# Altium schematic sheet Power_Supply.SchDoc: Wacky Racer Power Supply
size A3; Author: IPA & DHA; DrawnBy: IPA & DHA; Organization: Group 33; Address1: ECE Department; Address2: University of Canterbury; Address3: Christchurch 8041; Address4: New Zealand; DocumentNumber: 005; Revision: 1; SheetNumber: 3; SheetTotal: 3; ImagePath: \\maxwell\elecapp\AltiumDesigner\Templates\uc-logo.png
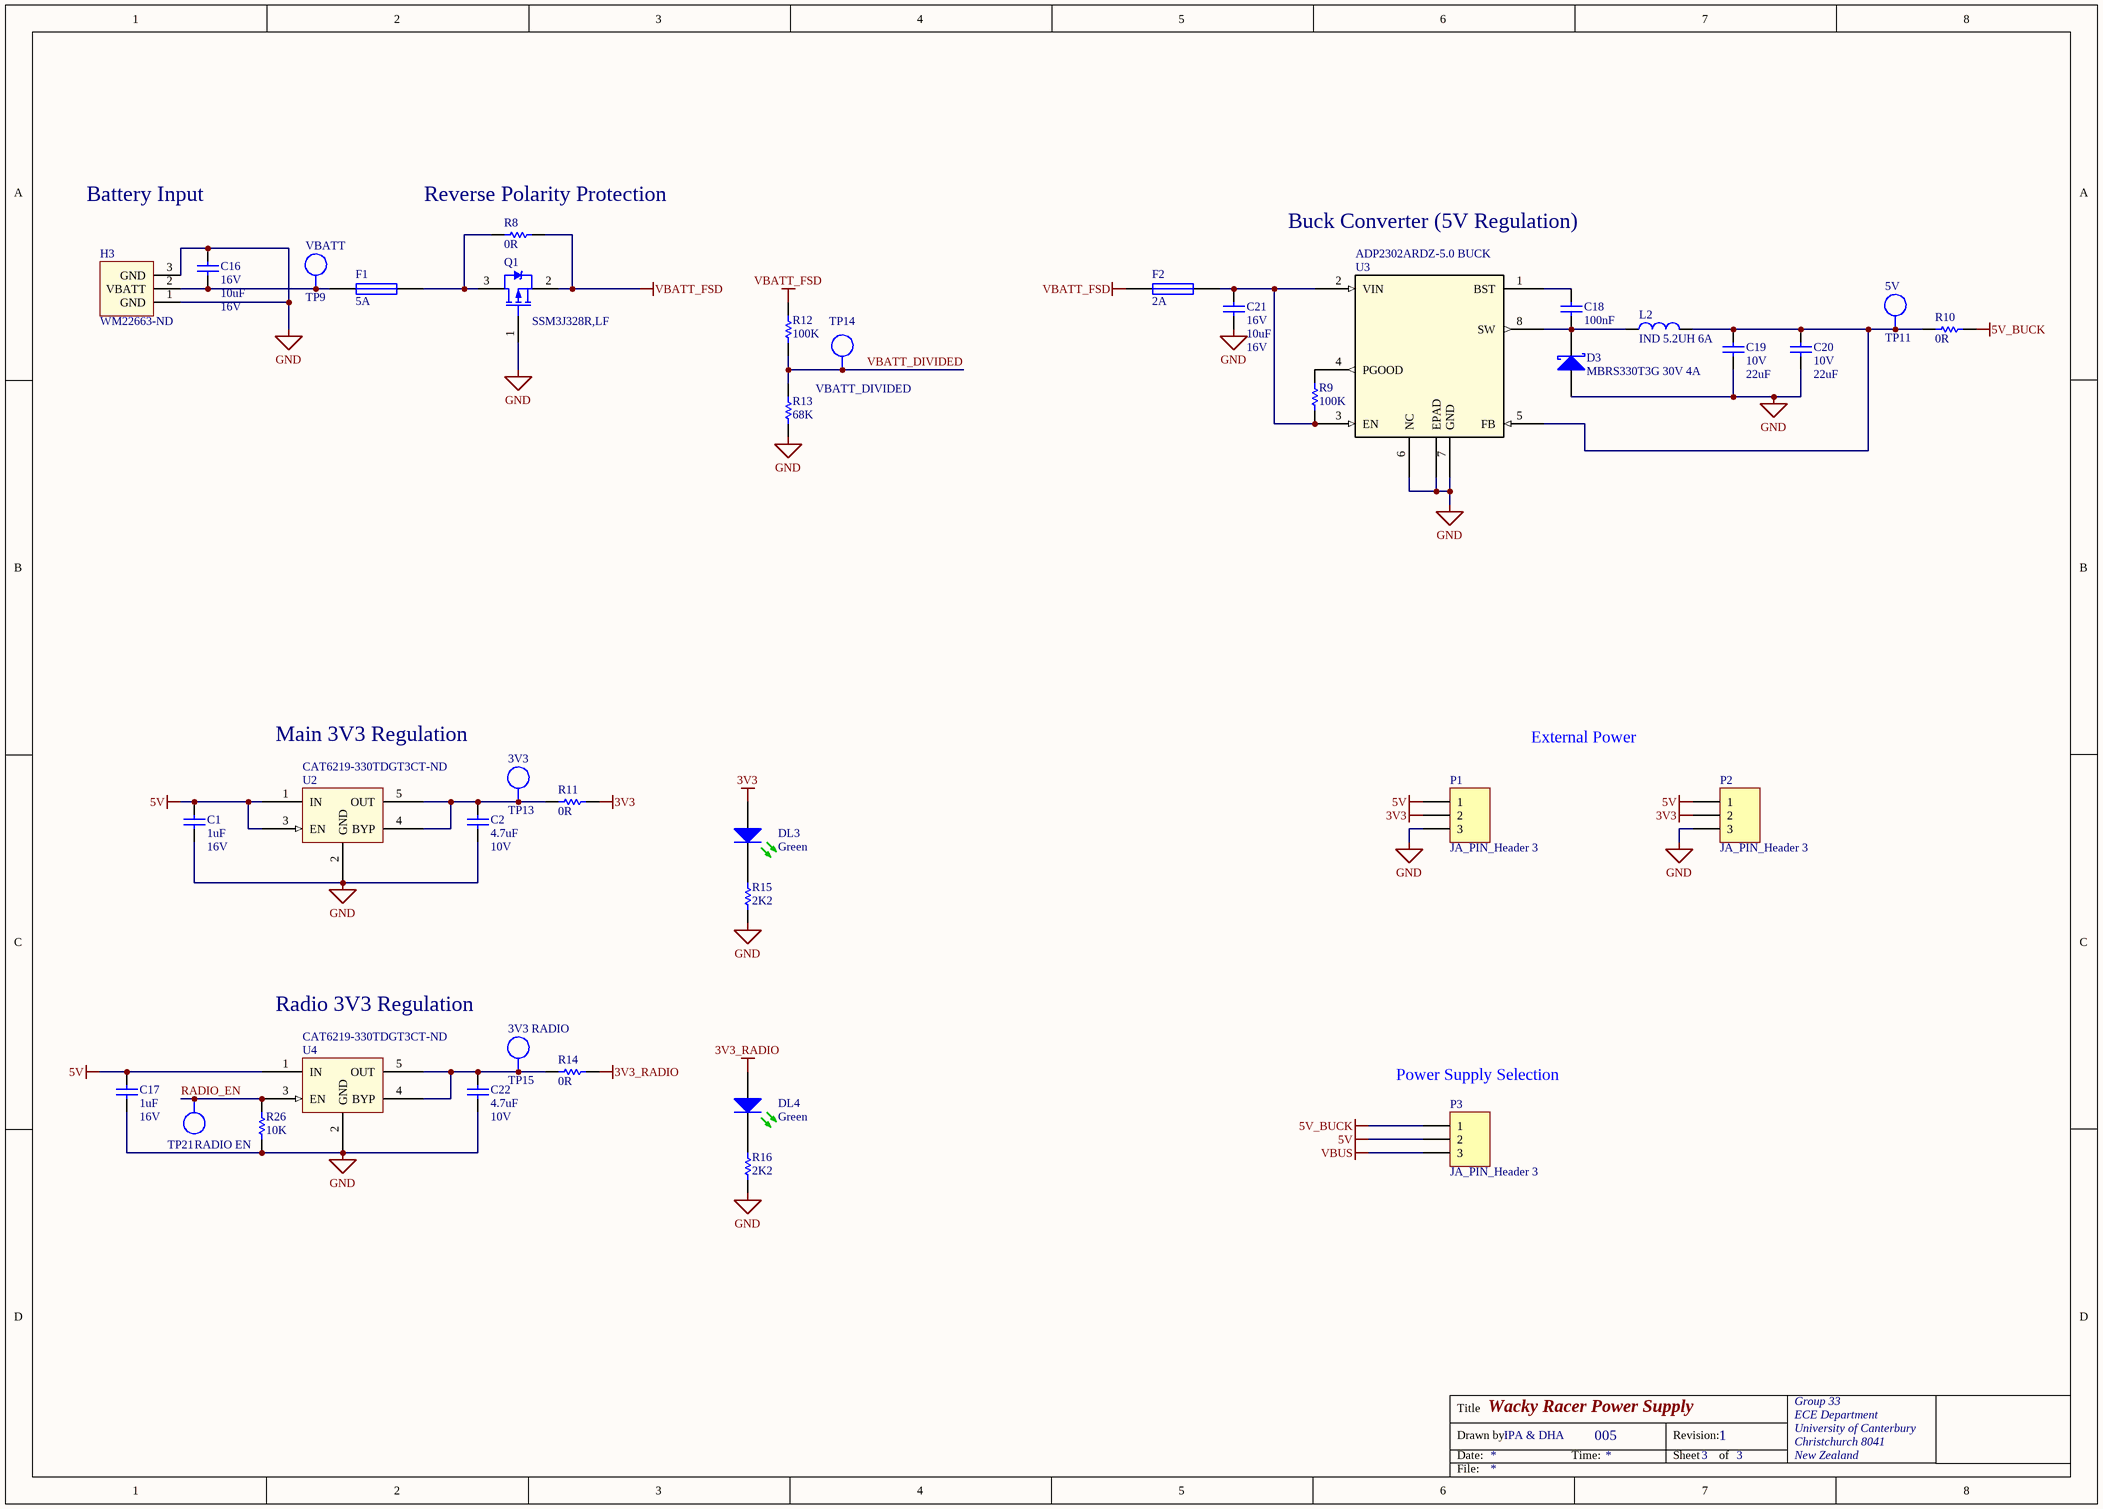
[diagram p0: Power_Supply.SchDoc]

## Parts
C1  Max Voltage: 16V  [CAPC1608L]  (hidden comment: 1uF)
C2  Max Voltage: 10V  [CAPC1608N]  (hidden comment: 4.7uF)
C16  Voltage - Rated: 16V  [CAPC2012L]  (hidden comment: 10uF)
C17  Max Voltage: 16V  [CAPC1608L]  (hidden comment: 1uF)
C18  100nF  [CAPC1608L]
C19  Max Voltage: 10V  [CAPC3216L]  (hidden comment: 22uF)
C20  Max Voltage: 10V  [CAPC3216L]  (hidden comment: 22uF)
C21  Voltage - Rated: 16V  [CAPC2012L]  (hidden comment: 10uF)
C22  Max Voltage: 10V  [CAPC1608N]  (hidden comment: 4.7uF)
D3  MBRS330T3G 30V 4A  [SMC]
DL3  Green  [WL-SMCW0603]
DL4  Green  [WL-SMCW0603]
F1  5A  [RESC3216N]
F2  2A  [RESC3216N]
H3  Supplier Part Number 1: WM22663-ND  [BATT_HEADER_3POS]  (hidden comment: Battery_HEADER_3pin)
L2  IND 5.2UH 6A  [INDUCTOR5u2]
P1  JA_PIN_Header 3  [HDR1X3]
P2  JA_PIN_Header 3  [HDR1X3]
P3  JA_PIN_Header 3  [HDR1X3]
Q1  SSM3J328R,LF  [SOT23_L]
R8  0R  [RESC1608L]
R9  100K  [RESC1608L]
R10  0R  [RESC1608L]
R11  0R  [RESC1608L]
R12  100K  [RESC1608L]
R13  68K  [RESC1608L]
R14  0R  [RESC1608L]
R15  2K2  [RESC1608L]
R16  2K2  [RESC1608L]
R26  10K  [RESC1608L]
TP9  VBATT  [TP_1206]  (no BOM)
TP11  5V  [TP_1206]  (no BOM)
TP13  3V3  [TP_1206]  (no BOM)
TP14  VBATT_DIVIDED  [TP_1206]  (no BOM)
TP15  3V3 RADIO  [TP_1206]  (no BOM)
TP21  RADIO EN  [TP_1206]  (no BOM)
U2  Supplier Part Number: CAT6219-330TDGT3CT-ND  [SOT95P280X145-5N]  (hidden comment: CAT6219-330TDGT3)
U3  ADP2302ARDZ-5.0 BUCK  [RD_8_1]
U4  Supplier Part Number: CAT6219-330TDGT3CT-ND  [SOT95P280X145-5N]  (hidden comment: CAT6219-330TDGT3)

## Nets
3V3: DL3.2(A) P1.2 P2.2 R11.2
3V3_RADIO: DL4.2(A) R14.2
5V: C1.1 C17.1 P1.1 P2.1 P3.2 U2.1(IN) U2.3(EN) U4.1(IN)
5V_BUCK: P3.1 R10.2
GND: C1.2 C2.1 C16.2 C17.2 C19.1 C20.1 C21.1 C22.1 D3.1(A) H3.1(GND) H3.3(GND) P1.3 P2.3 Q1.1 R13.1 R15.1 R16.1 R26.1 U2.2(GND) U3.6(NC) U3.7(GND) U3.EPAD U4.2(GND)
VBATT_FSD: F2.1 Q1.2 R8.2 R12.2
VBUS: P3.3
RADIO_EN: R26.2 TP21.1 U4.3(EN)
VBATT_DIVIDED: R12.1 R13.2 TP14.1
NetC2_2: C2.2 R11.1 TP13.1 U2.4(BYP) U2.5(OUT)
NetC16_1: C16.1 F1.1 H3.2(VBATT) TP9.1
NetC18_1: C18.1 D3.2(K) L2.1 U3.8(SW)
NetC18_2: C18.2 U3.1(BST)
NetC19_2: C19.2 C20.2 L2.2 R10.1 TP11.1 U3.5(FB)
NetC21_2: C21.2 F2.2 R9.1 U3.2(VIN) U3.3(EN)
NetC22_2: C22.2 R14.1 TP15.1 U4.4(BYP) U4.5(OUT)
NetDL3_1: DL3.1(K) R15.2
NetDL4_1: DL4.1(K) R16.2
NetF1_2: F1.2 Q1.3 R8.1
NetR9_2: R9.2 U3.4(PGOOD)

## Notes on the sheet
- Battery Input
- (near R8) Reverse Polarity Protection
- Buck Converter (5V Regulation)
- Main 3V3 Regulation
- External Power
- Radio 3V3 Regulation
- (near P3) Power Supply Selection
- Title
- Drawn by:
- Date:
- Time:
- Revision:
- Sheet
- of
- File:

## Library data of the parts
C1 C17 = CC_1uF_0603: CAP CER 1uF Y5V -20% +80% 16V 0603; PackageReference: 0603; Code_IPC: 1608 [0603]; Verify: *; Supplier: ECE Dept; Storage Location: PCB Assembly WS; Value: 1uF
C2 C22 = CC_4.7uF_0603: CAP CER 4.7uF X5R +-20%  10V 0603; Note: Footprint corresponds to dimensions for bulk cassette packaging. This case size has tightened tolerances.; PackageReference: 0805; Code_IPC: 2012[0805]; Verify: *; Supplier: ECE Dept; Storage Location: PCB Assembly WS; Value: 4.7uF
C16 C21 = CC_10uF_0805_16V: CAP CER 10uF X5R 16V 0805; Manufacturer: Samsung Electro-Mechanics; Manufacturer Part Number: CL21A106KOQNNWE; Note: Footprint corresponds to dimensions for bulk cassette packaging. This case size has tightened tolerances.; Tolerance: ±10%; Notification: Current market demand for these product types have resulted in fluctuating and extending lead times. Lead times may differ.; PackageReference: 0805; Code_IPC: 2012[0805]; Supplier 1: Digi-Key; RoHS: RoHS Compliant; Category: Capacitors; Stock 1: 20000; Pricing 1: 1=0.35, 10=0.25, 100=0.1178, 500=0.08254, 1000=0.06831 (NZD); Packaging: Cut Tape (CT); Part Status: Active; Temperature Coefficient: X5R; Operating Temperature: -55°C ~ 85°C; Features: -; Ratings: -; Applications: General Purpose; Mounting Type: Surface Mount, MLCC; Package / Case: 0805 (2012 Metric); Size / Dimension: 0.079" L x 0.049" W (2.00mm x 1.25mm); Height - Seated (Max): -; Thickness (Max): 0.055" (1.40mm); Lead Spacing: -; Lead Style: -; ComponentLink1URL: http://www.samsungsem.com/kr/support/product-search/mlcc/CL21A106KOQNNWE.jsp; ComponentLink1Description: http://www.samsungsem.com/kr/support/product-search/mlcc/CL21A106KOQNNWE.jsp; Supplier Part Number 1: 1276-2894-1-ND; Value: 10uF; Max Voltage: 16V
C18 = CC_100nF_0603: CAP CER 100nF X7R +-10% 50V 0603; PackageReference: 0603; Code_IPC: 1608 [0603]; Verify: *; Supplier: ECE Dept; Storage Location: PCB Assembly WS; Value: 100nF
C19 C20 = CC_22uF_1206: CAP CER 22uF Y5V -20% +80% 10V 1206; Verify: *; Supplier: ECE Dept; Storage Location: PCB Assembly WS; Dielectric: Y5V; Footprint: 1206 (3216 metric); Value: 22uF
D3 = MBRS330T3G: SCHOTTKY  30V 4A; Manufacturer: ON Semiconductor; Speed: Fast Recovery =< 500ns, > 200mA (Io); Supplier 1: Digi-Key; Manufacturer Part Number: MBRS330T3G; RoHS: RoHS Compliant; Category: Discrete Semiconductor Products; Stock 1: 8919; Pricing 1: 1=0.93, 10=0.79, 100=0.5902, 500=0.46368, 1000=0.35829 (NZD); Packaging: Cut Tape (CT); Part Status: Active; Diode Type: Schottky; Current - Average Rectified (Io): 4A; Capacitance @ Vr, F: -; Mounting Type: Surface Mount; Package / Case: DO-214AB, SMC; Supplier Device Package: SMC; Operating Temperature - Junction: -65°C ~ 150°C; Base Part Number: MBRS330; ComponentLink1URL: http://www.onsemi.com/pub/Collateral/MBRS340T3-D.PDF; ComponentLink1Description: http://www.onsemi.com/pub/Collateral/MBRS340T3-D.PDF; Supplier Part Number 1: MBRS330T3GOSCT-ND
DL3 DL4 = DL_150060GS75000: LED Green 430mcd 0603 SMD; Manufacturer: WURTH ELEKTRONIK; Forward Current If: 30; Wavelength Typ: 520; Forward Voltage: 3.2; Lens Shape: Rectangular; Luminous Intensity: 430; Viewing Angle: 140°; LED Mounting: SMD; Supplier 1: Farnell; Supplier Part Number 1: 2322070; Manufacturer Part Number: 150060GS75000; Storage Location: PCB Assembly WS; Supplier: ECE Dept; LED Colour: Green
F1 = FS_Fuse_5.0A: Fuse 5.0A Fast Acting 1206 SMD; Manufacturer Part Number: C1F5; Manufacturer: Bel TRP; Voltage Rating (AC): 125V; Voltage Rating (DC): 63V; DC Cold Resistance: 19mR; Fuse Type: Board Mount (Cartridge Style Excluded); Approvals: CE,cURus; Mount: Surface Mount; Case/Package: 1206; Number of Pins: 2; Case Code (Metric): 3216; Case Code (Imperial): 1206; Contact Plating: Nickel,Tin; Min Operating Temperature: -55°C; Max Operating Temperature: 125°C; Packaging: Tape and Reel; Voltage Rating: 125V; Length: 0.126inch; Width: 0.062inch; Supplier 1: Digi-Key; Stock 1: 725; Pricing 1: 1=0.32, 5=0.312, 10=0.298, 50=0.2662, 100=0.2479, 250=0.22032, 500=0.1836, 1000=0.17442 (USD); ComponentLink1URL: http://www.farnell.com/datasheets/2571625.pdf; ComponentLink1Description: http://www.farnell.com/datasheets/2571625.pdf; ComponentLink2URL: http://belfuse.com/pdfs/C1F.pdf; ComponentLink2Description: http://belfuse.com/pdfs/C1F.pdf; ComponentLink3URL: http://www.mouser.com/ds/2/643/C1F-594910.pdf; ComponentLink3Description: http://www.mouser.com/ds/2/643/C1F-594910.pdf; ComponentLink4URL: https://belfuse.com/resources/StewartConnector/C1F.pdf; ComponentLink4Description: https://belfuse.com/resources/StewartConnector/C1F.pdf; Current Rating: 5A; Supplier Part Number 1: 507-1886-1-ND; Supplier 2: Element14; Supplier Part Number 2: 2848595; Value: 5A
F2 = FS_Fuse_2.0A: Fuse 2.0A Very Fast Acting 1206 SMD; Manufacturer: MULTICOMP; Manufacturer PN: MC12CF 002; Supplier: ECE Dept; Storage Location: PCB Assembly WS; Supplier 1: Farnell; Supplier Part Number 1: 1841029; Manufacturer Part Number: MC12CF 002; Value: 2A
H3 = Battery_HEADER_3pin: 3Pin Header 2.54mm spacing / Digikey #WM22663-ND; Supplier 1: Digi-Key
L2 = CDRH104RNP-5R2NC: FIXED IND 5.2UH 6A 22 MOHM SMD; Manufacturer: Sumida America Components Inc.; Material - Core: Ferrite; Tolerance: ±30%; Current - Saturation: 5.6A; Shielding: Shielded; DC Resistance (DCR): 22 mOhm Max; Supplier 1: Digi-Key; Manufacturer Part Number: CDRH104RNP-5R2NC; RoHS: RoHS Compliant; Category: Inductors, Coils, Chokes; Stock 1: 3849; Pricing 1: 1=2.9, 10=2.678, 100=1.8743, 500=1.5173 (NZD); Packaging: Cut Tape (CT); Part Status: Active; Type: -; Q @ Freq: -; Frequency - Self Resonant: -; Ratings: -; Operating Temperature: -40°C ~ 100°C; Mounting Type: Surface Mount; Package / Case: Nonstandard; Supplier Device Package: -; Size / Dimension: 0.402" L x 0.394" W (10.20mm x 10.00mm); Height - Seated (Max): 0.157" (4.00mm); ComponentLink1URL: http://products.sumida.com/products/pdf/CDRH104R.pdf; ComponentLink1Description: http://products.sumida.com/products/pdf/CDRH104R.pdf; Supplier Part Number 1: 308-2280-1-ND
P1-P3 = JA_PIN_Header 3: Header, 3-Pin; LatestRevisionDate: 17-Jul-2002; LatestRevisionNote: Re-released for DXP Platform.; Publisher: Altium Limited
Q1 = TM_SSM3J328R: MOSFET P-CH 20V 6A SOT23-3; Manufacturer: Toshiba; FET Feature: Logic Level Gate, 1.5V Drive; FET Type: MOSFET P-Channel, Metal Oxide; Gate Charge (Qg) @ Vgs: 12.8nC @ 4.5V; Input Capacitance (Ciss) @ Vds: 840pF @ 10V; Power - Max: 1W; Rds On Max: 29.8mR; Drain to Source Resistance: 47.4mR; Turn-On Delay Time: 32ns; Power Dissipation: 2W; Number of Channels: 1; Turn-Off Delay Time: 107ns; Gate to Source Voltage (Vgs): 8V; Input Capacitance: 840pF; Element Configuration: Single; Drain to Source Breakdown Voltage: -20V; Vgs(th) (Max) @ Id: 1V @ 1mA; Current - Continuous Drain (Id) @ 25° C: 6A; Drain to Source Voltage (Vdss): 20V; Package / Case: SOT-23-3 Flat Leads; Supplier Device Package: SOT-23F; Pricing: 1=0.79, 10=0.658, 25=0.5772, 100=0.4939, 250=0.42836, 500=0.36284, 1000=0.27972 (NZD); Storage Location: PCB Assembly WS; Supplier: Digi-Key; ComponentLink1URL: https://datasheet.ciiva.com/11158/ssm3j328r-datasheet-en-20140301-11158652.pdf; ComponentLink1Description: https://datasheet.ciiva.com/11158/ssm3j328r-datasheet-en-20140301-11158652.pdf; Supplier Part Number: SSM3J328RLFDKR-ND; Max Operating Temperature: 150°C; Mount: Surface Mount; Packaging: Tape and Reel; Min Operating Temperature: -55°C; Continuous Drain Current (ID): 6A; Radiation Hardening: No; Max Power Dissipation: 1W; Package Quantity: 3000; Case/Package: SOT-23-3; Number of Pins: 3; Number of Elements: 1; Supplier 1: Digi-Key; Supplier Part Number 1: SSM3J328RLFDKR-ND; Manufacturer Part Number: SSM3J328R,LF
R8 R10 R11 R14 = RS_0R0: RES 0.0 OHM 1/10W 5% 0603 SMD; Storage Location: PCB Assembly WS; Supplier: ECE Dept; Value: 0R
R9 R12 = RS_100K: RES 100K OHM 1/10W 5% 0603 SMD; Storage Location: PCB Assembly WS; Supplier: ECE Dept; Value: 100K
R13 = RS_68K: RES 68.0K OHM 1/10W 5% 0603 SMD; Storage Location: PCB Assembly WS; Supplier: ECE Dept; Value: 68K
R15 R16 = RS_2K2: RES 2.2K OHM 1/10W 5% 0603 SMD; Storage Location: PCB Assembly WS; Supplier: ECE Dept; Value: 2K2
R26 = RS_10K: RES 10.0K OHM 1/10W 5% 0603 SMD; Storage Location: PCB Assembly WS; Supplier: ECE Dept; Value: 10K
TP9 TP11 TP13-TP15 TP21 = TP_1206: Test-Point 3.3x1.6x2.1mm SMD; Manufacturer: Harwin Inc; Manufacturer Part Number: S1751-46R; Value: TP; Manufacturer PN: *; Storage Location: ProtoPlace; Mounting Type: Surface Mount; Type: PC Test Point; Supplier 1: Digi-Key; Supplier Part Number 1: 952-1478-2-ND; Supplier 2: Farnell; Supplier Part Number 2: 1826282; Supplier: ECE Dept
U2 U4 = SV_CAT6219-330TDGT3: IC REG LIN 3.3V 500MA TSOT23-5; Voltage - Input (Max): 5.5V; Voltage Dropout (Max): 0.5V @ 500mA; Manufacturer Part Number: CAT6219-330TDGT3; Base Part Number: CAT6219; Current - Output: 500mA; Package / Case: SOT-23-5 Thin, TSOT-23-5; Supplier: Digi-Key; Supplier Device Package: TSOT-23-5; Voltage - Output (Min/Fixed): 3.3V; ComponentLink1URL: http://www.onsemi.com/pub/Collateral/CAT6219-D.PDF; ComponentLink1Description: http://www.onsemi.com/pub/Collateral/CAT6219-D.PDF; Supplier 1: Digi-Key; ComponentLink2Description: CAT6219 Datasheet; ComponentLink2URL: \\maxwell\elecapp\AltiumDesigner\Libraries\DatasheetsNew\ENCE461\CAT6219-D.PDF
U3 = ADP2302ARDZ-5.0-R7: IC REG BUCK 5V 2A 8SOIC; Vendor: Analog Devices Inc; Frequency - Switching: 700kHz; Output Type: Fixed; Voltage - Input (Max): 20V; Manufacturer_Part_Number: ADP2302ARDZ-5.0-R7; Type: DEV; Value: Value; Supplier 1: Digi-Key; Current - Output: 2A; Voltage - Output (Min/Fixed): 5V; Supplier Part Number 1: ADP2302ARDZ-5.0-R7CT-ND; ComponentLink1Description: ADP2302ARDZ-5.0 Datasheet; ComponentLink1URL: \\maxwell\elecapp\AltiumDesigner\Libraries\DatasheetsNew\ENCE461\ADP2302_2303.pdf